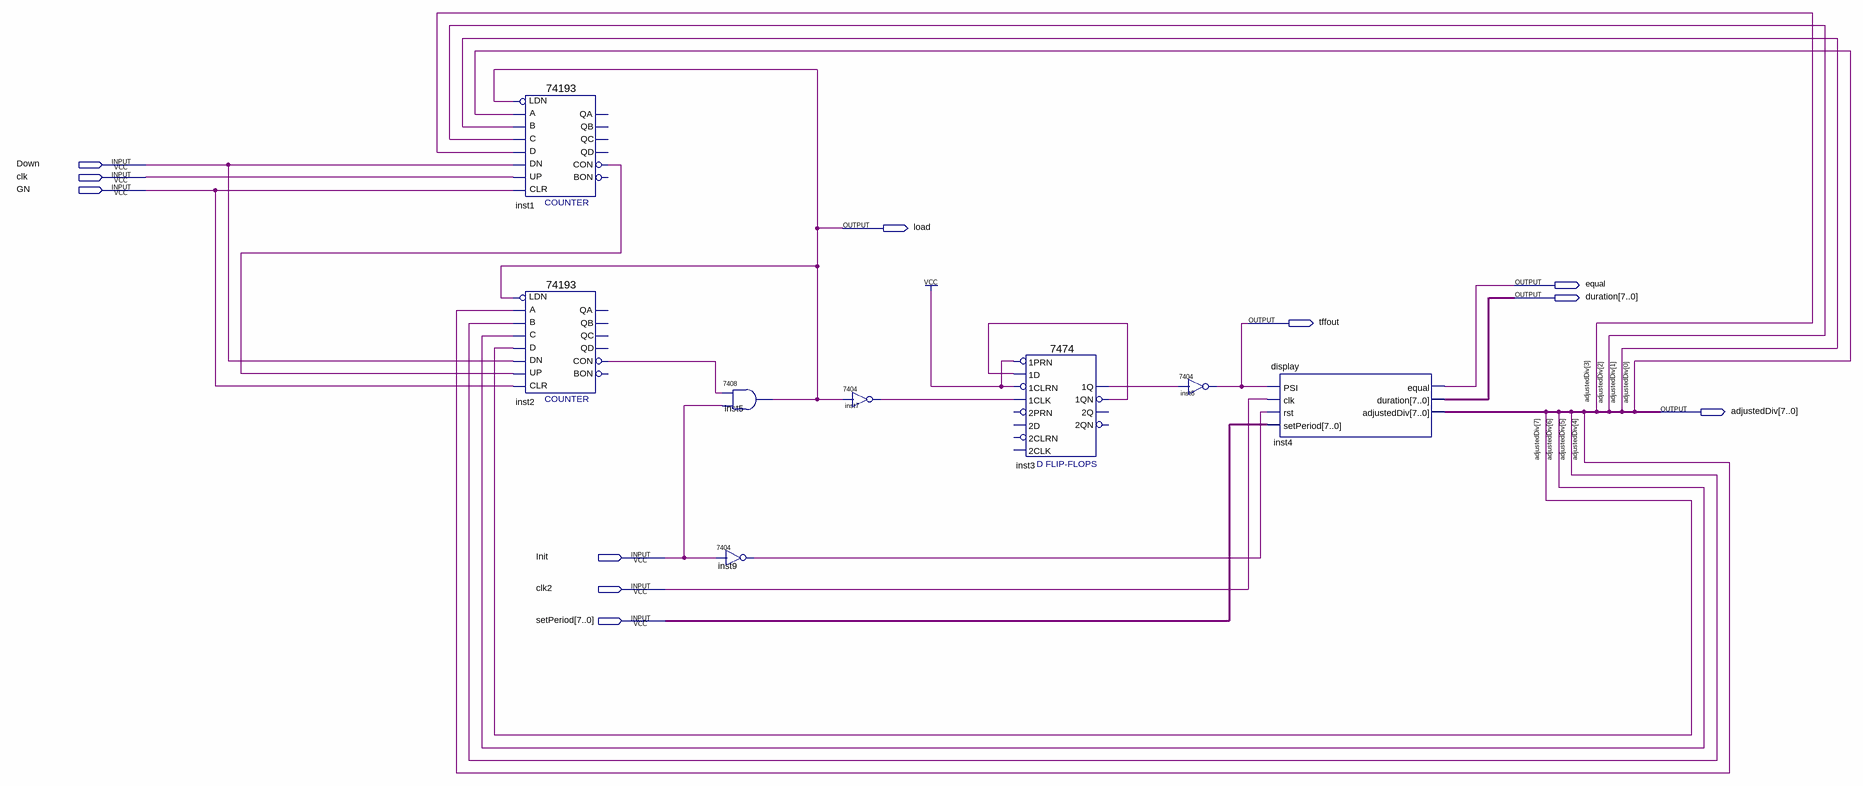
[diagram p0: schematic sheet]
// Quartus schematic FreqRegulator.bdf as structural Verilog: 8 symbols, 11 pins
module FreqRegulator (
  input  Down,
  input  clk,
  input  GN,
  input  Init,
  input  clk2,
  input  [7:0] setPeriod,
  output load,
  output equal,
  output [7:0] duration,
  output tffout,
  output [7:0] adjustedDiv
);

  wire inst1_con, inst2_con, inst3_1q, inst3_1qn, inst7_1, inst9_1;

  \74193  inst1 (
    .D(adjustedDiv[3]), .C(adjustedDiv[2]), .B(adjustedDiv[1]), .A(adjustedDiv[0]), .CLR(GN), .UP(clk),
    .DN(Down), .LDN(load), .CON(inst1_con));  // open: QB, QA, QD, QC, BON
  \74193  inst2 (
    .D(adjustedDiv[7]), .C(adjustedDiv[6]), .B(adjustedDiv[5]), .A(adjustedDiv[4]), .CLR(GN), .UP(inst1_con),
    .DN(Down), .LDN(load), .CON(inst2_con));  // open: QB, QA, QD, QC, BON
  \7408  inst5 (.\3 (Init), .\2 (inst2_con), .\1 (load));
  \7404  inst9 (.\2 (Init), .\1 (inst9_1));
  \7404  inst7 (.\2 (load), .\1 (inst7_1));
  \7474  inst3 (
    .\1CLK (inst7_1), .\1D (inst3_1qn), .\1PRN (1'b1), .\1CLRN (1'b1), .\1QN (inst3_1qn), .\1Q (inst3_1q));  // open: 2D, 2PRN, 2CLK, 2CLRN, 2Q, 2QN
  \7404  inst8 (.\2 (inst3_1q), .\1 (tffout));
  display inst4 (
    .PSI(tffout), .clk(clk2), .rst(inst9_1), .setPeriod(setPeriod), .equal(equal), .duration(duration),
    .adjustedDiv(adjustedDiv));
endmodule
